# EAGLE schematic Encoder_Rotary_Magnetic_AS5XXX (EAGLE 6.5.0)
Rotary Encoder: AS5XXX QEP/PWM AS5040 Rotary Sensor <http://www.ams.com/eng/Products/Position-Sensors/Magnetic-Rotary-Position-Sensors/AS5040>: 10 bit sensor AS5145A Rotary Sensor <http://www.ams.com/eng/Products/Position-Sensors/Magnetic-Rotary-Position-Sensors/AS5145A>: QEP preprogrammed for 10 bit AS5145B Rotary Sensor <http://www.ams.com/eng/Products/Position-Sensors/Magnetic-Rotary-Position-Sensors/AS5145B>: QEP preprogrammed for 12 bit
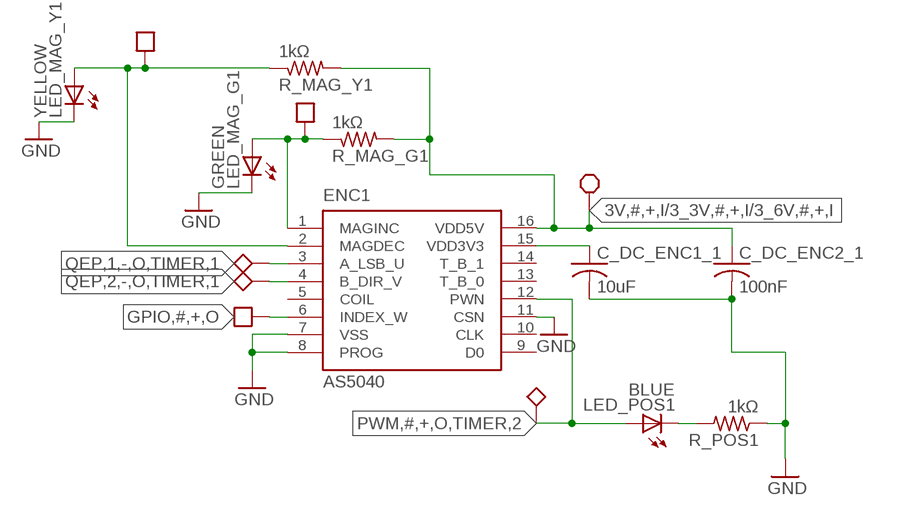
[diagram p0: schematic, sheet 1]

## Parts
C_DC_ENC1_1  10uF  C-USC0603  [C0603]
C_DC_ENC2_1  100nF  C-USC0603  [C0603]
ENC1  AS5040  [SSOP16]
LED_MAG_G1  GREEN  LEDCHIP-LED0603  [CHIP-LED0603]
LED_MAG_Y1  YELLOW  LEDCHIP-LED0603  [CHIP-LED0603]
LED_POS1  BLUE  LEDCHIP-LED0603  [CHIP-LED0603]
R_MAG_G1  1kΩ  R-US_R0603  [R0603]
R_MAG_Y1  1kΩ  R-US_R0603  [R0603]
R_POS1  1kΩ  R-US_R0603  [R0603]

## Nets
3V,#,+,I/3_3V,#,+,I/3_6V,#,+,I: C_DC_ENC2_1.1 ENC1.16(VDD5V) R_MAG_G1.2 R_MAG_Y1.2 ; supply symbol labelled BLOCK_REQUIREMENT
ENC_3V3_1: C_DC_ENC1_1.1 ENC1.15(VDD3V3)
GND: C_DC_ENC1_1.2 C_DC_ENC2_1.2 ENC1.7(VSS) ENC1.8(PROG) ENC1.11(CSN) LED_MAG_G1.C LED_MAG_Y1.C R_POS1.1
GPIO,#,+,O: ENC1.6(INDEX_W) ; supply symbol labelled BLOCK_OPTIONAL
MAGDEC1: ENC1.2(MAGDEC) LED_MAG_Y1.A R_MAG_Y1.1 ; supply symbol labelled BLOCK_OPTIONAL
MAGINC1: ENC1.1(MAGINC) LED_MAG_G1.A R_MAG_G1.1 ; supply symbol labelled BLOCK_OPTIONAL
POS_PWM_LED1: LED_POS1.C R_POS1.2
PWM,#,+,O,TIMER,2: ENC1.12(PWN) LED_POS1.A ; supply symbol labelled BLOCK_RECOMMENDED
QEP,1,-,O,TIMER,1: ENC1.3(A_LSB_U) ; supply symbol labelled BLOCK_RECOMMENDED
QEP,2,-,O,TIMER,1: ENC1.4(B_DIR_V) ; supply symbol labelled BLOCK_RECOMMENDED
Unconnected: ENC1.5(COIL) ENC1.9(D0) ENC1.10(CLK) ENC1.13(T_B_0) ENC1.14(T_B_1)

## Library data of the parts
C_DC_ENC1_1 C_DC_ENC2_1 = resistor:C-US: CAPACITOR, American symbol
ENC1 = austriamicrosystems:AS5040: 10-BIT PROGRAMMABLE MAGNETIC ROTARY ENCODER Source: www.austriamicrosystems.com .. AS5040DataSheetRev12.pdf; MPN: AS5040ASSU; OC_FARNELL: 1630800; OC_NEWARK: 59P4059
LED_MAG_G1 LED_MAG_Y1 LED_POS1 = led:LED: LED OSRAM: - CHIPLED LG R971, LG N971, LY N971, LG Q971, LY Q971, LO R971, LY R971 LH N974, LH R974 LS Q976, LO Q976, LY Q976 LO Q996 - Hyper CHIPLED LW Q18S LB Q993, LB Q99A, LB R99A - SideLED LS A670, LO A670, LY A670, LG A670, LP A670 LB A673, LV A673, LT A673, LW A673 LH A674 LY A675 LS A676, LA A676, LO A676, LY A676, LW A676 LS A679, LY A679, LG A679 - Hyper Micro SIDELED® LS Y876, LA Y876, LO Y876, LY Y876 LT Y87S - SmartLED LW L88C, LW L88S LB L89C, LB L89S, LG L890 LS L89K, LO L89K, LY L89K LS L896, LA L896, LO L896, LY L896 - TOPLED LS T670, LO T670, LY T670, LG T670, LP T670 LSG T670, LSP T670, LSY T670, LOP T670, LYG T670 LG T671, LOG T671, LSG T671 LB T673, LV T673, LT T673, LW T673 LH T674 LS T676, LA T676, LO T676, LY T676, LB T676, LH T676, LSB T676, LW T676 LB T67C, LV T67C, LT T67C, LS T67K, LO T67K, LY T67K, LW E67C LS E67B, LA E67B, LO E67B, LY E67B, LB E67C, LV E67C, LT E67C LW T67C LS T679, LY T679, LG T679 LS T770, LO T770, LY T770, LG T770, LP T770 LB T773, LV T773, LT T773, LW T773 LH T774 LS E675, LA E675, LY E675, LS T675 LS T776, LA T776, LO T776, LY T776, LB T776 LHGB T686 LT T68C, LB T68C - Hyper Mini TOPLED® LB M676 - Mini TOPLED Santana® LG M470 LS M47K, LO M47K, LY M47K Source: http://www.osram.convergy.de LUXEON: - LUMILED® LXK2-PW12-R00, LXK2-PW12-S00, LXK2-PW14-U00, LXK2-PW14-V00 LXK2-PM12-R00, LXK2-PM12-S00, LXK2-PM14-U00 LXK2-PE12-Q00, LXK2-PE12-R00, LXK2-PE12-S00, LXK2-PE14-T00, LXK2-PE14-U00 LXK2-PB12-K00, LXK2-PB12-L00, LXK2-PB12-M00, LXK2-PB14-N00, LXK2-PB14-P00, LXK2-PB14-Q00 LXK2-PR12-L00, LXK2-PR12-M00, LXK2-PR14-Q00, LXK2-PR14-R00 LXK2-PD12-Q00, LXK2-PD12-R00, LXK2-PD12-S00 LXK2-PH12-R00, LXK2-PH12-S00 LXK2-PL12-P00, LXK2-PL12-Q00, LXK2-PL12-R00 Source: www.luxeon.com KINGBRIGHT: KA-3528ASYC Source: www.kingbright.com
R_MAG_G1 R_MAG_Y1 R_POS1 = resistor:R-US_: RESISTOR, American symbol

## Net classes
4 xxwide: width 0.203 mm